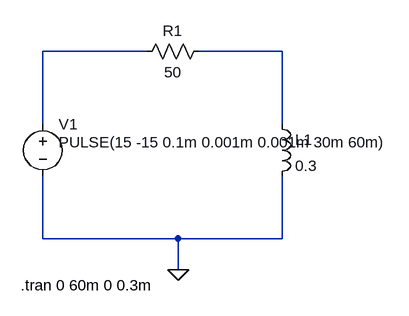
[diagram p0: schematic schemeLC.asc]
schemeLC.asc, the LTspice schematic file:
Version 4
SHEET 1 880 680
WIRE 192 96 32 96
WIRE 400 96 272 96
WIRE 32 208 32 96
WIRE 400 208 400 96
WIRE 32 384 32 288
WIRE 240 384 32 384
WIRE 400 384 400 288
WIRE 400 384 240 384
WIRE 240 432 240 384
FLAG 240 432 0
SYMBOL res 288 80 R90
WINDOW 0 0 56 VBottom 2
WINDOW 3 32 56 VTop 2
SYMATTR InstName R1
SYMATTR Value 50
SYMBOL ind 384 192 R0
SYMATTR InstName L1
SYMATTR Value 0.3
SYMBOL voltage 32 192 R0
WINDOW 3 24 44 Left 2
WINDOW 123 0 0 Left 0
WINDOW 39 0 0 Left 0
SYMATTR InstName V1
SYMATTR Value PULSE(15 -15 0.1m 0.001m 0.001m 30m 60m)
TEXT -2 456 Left 2 !.tran 0 60m 0 0.3m

The netlist it stands for:
* schemeLC.asc
R1 N002 N001 50
L1 N002 0 0.3
V1 N001 0 PULSE(15 -15 0.1m 0.001m 0.001m 30m 60m)
.tran 0 60m 0 0.3m
.backanno
.end